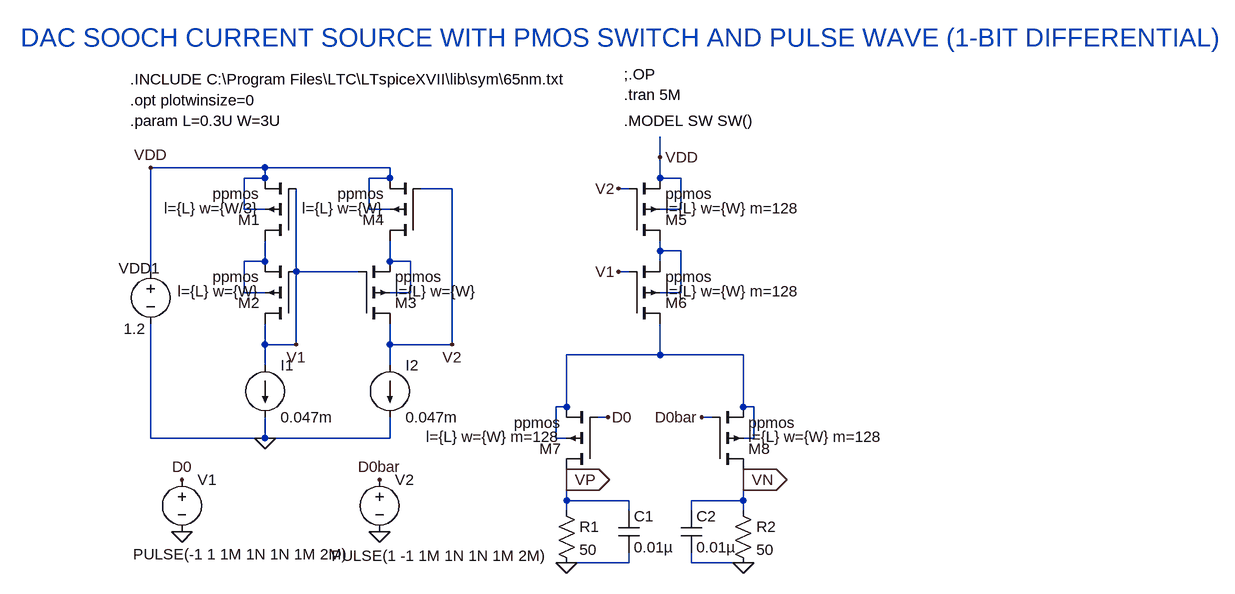
[diagram p0: schematic 105DAC_DIFF_SOOCH_PMOS_SW_PULSE_1BIT.asc]
105DAC_DIFF_SOOCH_PMOS_SW_PULSE_1BIT.asc, the LTspice schematic file:
Version 4
SHEET 1 1540 680
WIRE -448 -336 -448 -368
WIRE -1056 -320 -1232 -320
WIRE -864 -320 -1056 -320
WIRE -1056 -304 -1056 -320
WIRE -1056 -304 -1088 -304
WIRE -864 -304 -864 -320
WIRE -864 -304 -896 -304
WIRE -448 -304 -448 -336
WIRE -416 -304 -448 -304
WIRE -768 -288 -816 -288
WIRE -496 -288 -512 -288
WIRE -1088 -256 -1088 -304
WIRE -1056 -256 -1088 -256
WIRE -896 -256 -896 -304
WIRE -864 -256 -896 -256
WIRE -416 -256 -416 -304
WIRE -416 -256 -448 -256
WIRE -448 -192 -448 -208
WIRE -416 -192 -448 -192
WIRE -1056 -176 -1056 -208
WIRE -1056 -176 -1088 -176
WIRE -864 -176 -864 -208
WIRE -832 -176 -864 -176
WIRE -448 -176 -448 -192
WIRE -1232 -160 -1232 -320
WIRE -1008 -160 -1008 -288
WIRE -912 -160 -1008 -160
WIRE -496 -160 -512 -160
WIRE -1088 -128 -1088 -176
WIRE -1056 -128 -1088 -128
WIRE -832 -128 -832 -176
WIRE -832 -128 -864 -128
WIRE -416 -128 -416 -192
WIRE -416 -128 -448 -128
WIRE -1056 -48 -1056 -80
WIRE -1008 -48 -1008 -160
WIRE -1008 -48 -1056 -48
WIRE -864 -48 -864 -80
WIRE -768 -48 -768 -288
WIRE -768 -48 -864 -48
WIRE -448 -32 -448 -80
WIRE -448 -32 -592 -32
WIRE -320 -32 -448 -32
WIRE -1056 -16 -1056 -48
WIRE -864 -16 -864 -48
WIRE -592 48 -592 -32
WIRE -592 48 -608 48
WIRE -320 48 -320 -32
WIRE -304 48 -320 48
WIRE -528 64 -544 64
WIRE -368 64 -384 64
WIRE -1232 96 -1232 -80
WIRE -1056 96 -1056 64
WIRE -1056 96 -1232 96
WIRE -864 96 -864 64
WIRE -864 96 -1056 96
WIRE -608 96 -608 48
WIRE -592 96 -608 96
WIRE -304 96 -304 48
WIRE -304 96 -320 96
WIRE -592 160 -592 144
WIRE -320 160 -320 144
WIRE -592 192 -592 160
WIRE -496 192 -592 192
WIRE -320 192 -320 160
WIRE -320 192 -400 192
WIRE -592 208 -592 192
WIRE -496 208 -496 192
WIRE -400 208 -400 192
WIRE -320 208 -320 192
WIRE -496 288 -496 272
WIRE -496 288 -592 288
WIRE -400 288 -400 272
WIRE -320 288 -400 288
FLAG -1008 -48 V1
FLAG -512 -160 V1
FLAG -768 -48 V2
FLAG -512 -288 V2
FLAG -448 -336 VDD
FLAG -1232 -320 VDD
FLAG -592 288 0
FLAG -1056 96 0
FLAG -1184 240 0
FLAG -1184 160 D0
FLAG -592 160 VP
IOPIN -592 160 Out
FLAG -528 64 D0
FLAG -320 288 0
FLAG -320 160 VN
IOPIN -320 160 Out
FLAG -384 64 D0bar
FLAG -880 240 0
FLAG -880 160 D0bar
SYMBOL pmos4 -1008 -208 R180
WINDOW 123 56 50 Left 2
SYMATTR Value2 l={L} w={W/3}
SYMATTR InstName M1
SYMATTR Value ppmos
SYMBOL pmos4 -1008 -80 R180
WINDOW 123 56 50 Left 2
SYMATTR Value2 l={L} w={W}
SYMATTR InstName M2
SYMATTR Value ppmos
SYMBOL current -1056 -16 R0
WINDOW 123 0 0 Left 0
WINDOW 39 0 0 Left 0
SYMATTR InstName I1
SYMATTR Value 0.047m
SYMBOL pmos4 -912 -80 M180
WINDOW 123 56 50 Left 2
SYMATTR Value2 l={L} w={W}
SYMATTR InstName M3
SYMATTR Value ppmos
SYMBOL pmos4 -816 -208 R180
WINDOW 123 56 50 Left 2
SYMATTR Value2 l={L} w={W}
SYMATTR InstName M4
SYMATTR Value ppmos
SYMBOL current -864 -16 R0
WINDOW 123 0 0 Left 0
WINDOW 39 0 0 Left 0
SYMATTR InstName I2
SYMATTR Value 0.047m
SYMBOL pmos4 -496 -208 M180
WINDOW 123 56 50 Left 2
SYMATTR Value2 l={L} w={W} m=128
SYMATTR InstName M5
SYMATTR Value ppmos
SYMBOL pmos4 -496 -80 M180
WINDOW 123 56 50 Left 2
SYMATTR Value2 l={L} w={W} m=128
SYMATTR InstName M6
SYMATTR Value ppmos
SYMBOL voltage -1232 -176 R0
WINDOW 123 0 0 Left 0
WINDOW 39 0 0 Left 0
WINDOW 0 -49 11 Left 2
WINDOW 3 -42 104 Left 2
SYMATTR InstName VDD1
SYMATTR Value 1.2
SYMBOL res -608 192 R0
SYMATTR InstName R1
SYMATTR Value 50
SYMBOL voltage -1184 144 R0
WINDOW 123 0 0 Left 0
WINDOW 39 0 0 Left 0
WINDOW 3 -75 131 Left 2
SYMATTR Value PULSE(-1 1 1M 1N 1N 1M 2M)
SYMATTR InstName V1
SYMBOL pmos4 -544 144 R180
WINDOW 123 56 50 Left 2
SYMATTR Value2 l={L} w={W} m=128
SYMATTR InstName M7
SYMATTR Value ppmos
SYMBOL cap -512 208 R0
SYMATTR InstName C1
SYMATTR Value 0.01µ
SYMBOL res -336 192 R0
SYMATTR InstName R2
SYMATTR Value 50
SYMBOL pmos4 -368 144 M180
WINDOW 123 56 50 Left 2
SYMATTR Value2 l={L} w={W} m=128
SYMATTR InstName M8
SYMATTR Value ppmos
SYMBOL cap -416 208 R0
SYMATTR InstName C2
SYMATTR Value 0.01µ
SYMBOL voltage -880 144 R0
WINDOW 123 0 0 Left 0
WINDOW 39 0 0 Left 0
WINDOW 3 -74 133 Left 2
SYMATTR Value PULSE(1 -1 1M 1N 1N 1M 2M)
SYMATTR InstName V2
TEXT -1264 -456 Left 2 !.INCLUDE C:\\Program Files\\LTC\\LTspiceXVII\\lib\\sym\\65nm.txt
TEXT -1264 -424 Left 2 !.opt plotwinsize=0
TEXT -504 -464 Left 2 !;.OP
TEXT -1264 -392 Left 2 !.param L=0.3U W=3U
TEXT -504 -432 Left 2 !.tran 5M
TEXT -504 -392 Left 2 !.MODEL SW SW()
TEXT -1432 -520 Left 4 ;DAC SOOCH CURRENT SOURCE WITH PMOS SWITCH AND PULSE WAVE (1-BIT DIFFERENTIAL)

The netlist it stands for:
* 105DAC_DIFF_SOOCH_PMOS_SW_PULSE_1BIT.asc
M1 N002 V1 VDD VDD ppmos l={L} w={W/3}
M2 V1 V1 N002 N002 ppmos l={L} w={W}
I1 V1 0 0.047m
M3 V2 V1 N003 N003 ppmos l={L} w={W}
M4 N003 V2 VDD VDD ppmos l={L} w={W}
I2 V2 0 0.047m
M5 N001 V2 VDD VDD ppmos l={L} w={W} m=128
M6 N004 V1 N001 N001 ppmos l={L} w={W} m=128
VDD1 VDD 0 1.2
R1 VP 0 50
V1 D0 0 PULSE(-1 1 1M 1N 1N 1M 2M)
M7 VP D0 N004 N004 ppmos l={L} w={W} m=128
C1 VP 0 0.01µ
R2 VN 0 50
M8 VN D0bar N004 N004 ppmos l={L} w={W} m=128
C2 VN 0 0.01µ
V2 D0bar 0 PULSE(1 -1 1M 1N 1N 1M 2M)
.model NMOS NMOS
.model PMOS PMOS
.lib standard.mos
.INCLUDE C:\Program Files\LTC\LTspiceXVII\lib\sym\65nm.txt
.opt plotwinsize=0
;.OP
.param L=0.3U W=3U
.tran 5M
.MODEL SW SW()
* DAC SOOCH CURRENT SOURCE WITH PMOS SWITCH AND PULSE WAVE (1-BIT DIFFERENTIAL)
.backanno
.end